# Altium schematic sheet MachSim.SchDoc
size 449 x 279 mm
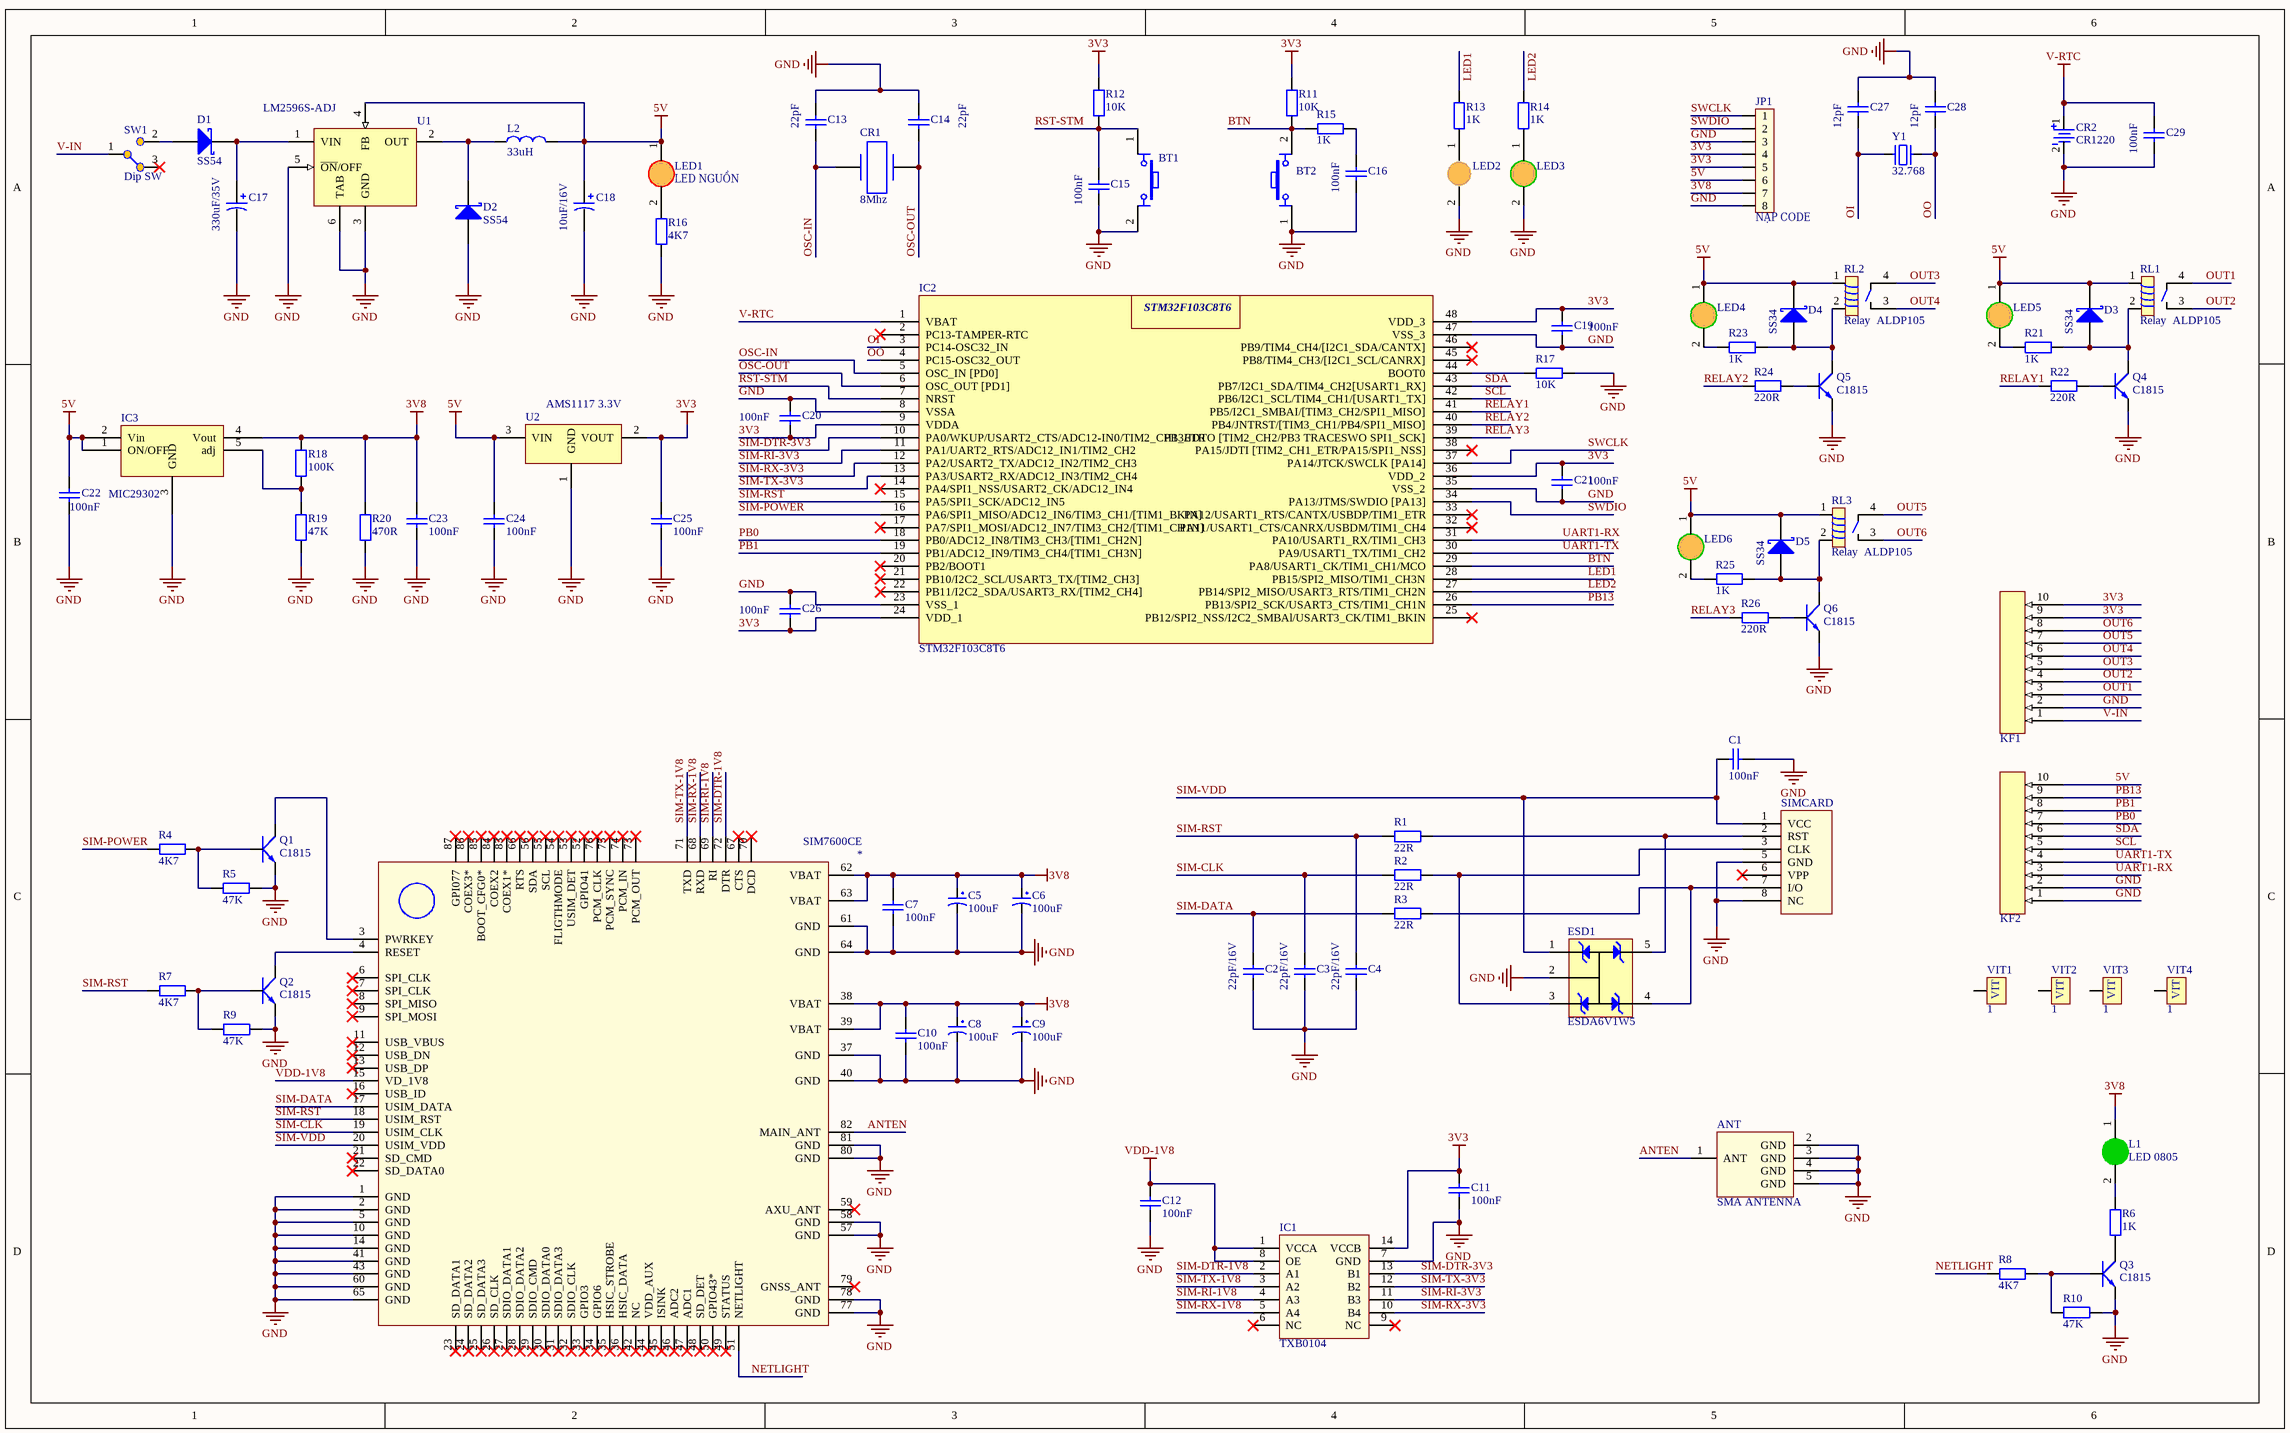
[diagram p0: MachSim.SchDoc]

## Parts
*  SIM7600CE  [SIM7600C]
ANT  ANT?  [ANT]  (value not drawn)
BT1  Nut Nhan 4 Chan Cam 6x6  [Nut Nhan 4 Chan Cam 6x6]  (value not drawn)
BT2  Nut Nhan 4 Chan Cam 6x6  [Nut Nhan 4 Chan Cam 6x6]  (value not drawn)
C1  100nF  [tu 0805]
C2  22pF/16V  [tu 0805]
C3  22pF/16V  [tu 0805]
C4  22pF/16V  [tu 0805]
C5  100uF  [tu tantalum smd3528]
C6  100uF  [tu tantalum smd3528]
C7  100nF  [tu 0805]
C8  100uF  [tu tantalum smd3528]
C9  100uF  [tu tantalum smd3528]
C10  100nF  [tu 0805]
C11  100nF  [tu 0805]
C12  100nF  [tu 0805]
C13  22pF  [tu 0805]
C14  22pF  [tu 0805]
C15  100nF  [tu 0805]
C16  100nF  [tu 0805]
C17  330uF/35V  [CAP_ALUM_SMD_100102_TYPE_G]
C18  10uF/16V  [CAP_ALUM_SMD_5054_TYPE_C]
C19  100nF  [tu 0805]
C20  100nF  [tu 0805]
C21  100nF  [tu 0805]
C22  100nF  [tu 0805]
C23  100nF  [tu 0805]
C24  100nF  [tu 0805]
C25  100nF  [tu 0805]
C26  100nF  [tu 0805]
C27  12pF  [tu 0805]
C28  12pF  [tu 0805]
C29  100nF  [tu 0805]
CR1  8Mhz  [Cry]
CR2  CR1220  [CR1220_HOLDER_SMD]
D1  SS54  [SS54]
D2  SS54  [SS54]
D3  SS34  [DIODE_DO214AC_SMA]
D4  SS34  [DIODE_DO214AC_SMA]
D5  SS34  [DIODE_DO214AC_SMA]
ESD1  ESDA6V1W5  [ESDA6V1W5]
IC1  TXB0104  [TXB0104]  (value not drawn)
IC2  STM32F103C8T6  [LQFP48]
IC3  MIC29302  [Mic5V]
JP1  NẠP CODE  [Jump Don Duc Thang 2.54_8p]
KF1  KF142R-10  [KF10]  (value not drawn)
KF2  KF142R-10  [KF10]  (value not drawn)
L1  LED 0805  [LED-0805-Green]
L2  33uH  [cuon cam cd74]
LED1  LED NGUỒN  [led 0805]
LED2  led trang 0805  [led 0805]  (value not drawn)
LED3  led xanh la 0805  [led 0805]  (value not drawn)
LED4  led xanh la 0805  [led 0805]  (value not drawn)
LED5  led xanh la 0805  [led 0805]  (value not drawn)
LED6  led xanh la 0805  [led 0805]  (value not drawn)
Q1  C1815  [SOT23B]
Q2  C1815  [SOT23B]
Q3  C1815  [SOT23B]
Q4  C1815  [SOT23B]
Q5  C1815  [SOT23B]
Q6  C1815  [SOT23B]
R1  22R  [tro 0805]
R2  22R  [tro 0805]
R3  22R  [tro 0805]
R4  4K7  [tro 0805]
R5  47K  [tro 0805]
R6  1K  [tro 0805]
R7  4K7  [tro 0805]
R8  4K7  [tro 0805]
R9  47K  [tro 0805]
R10  47K  [tro 0805]
R11  10K  [tro 0805]
R12  10K  [tro 0805]
R13  1K  [tro 0805]
R14  1K  [tro 0805]
R15  1K  [tro 0805]
R16  4K7  [tro 0805]
R17  10K  [tro 0805]
R18  100K  [tro 0805]
R19  47K  [tro 0805]
R20  470R  [tro 0805]
R21  1K  [tro 0805]
R22  220R  [tro 0805]
R23  1K  [tro 0805]
R24  220R  [tro 0805]
R25  1K  [tro 0805]
R26  220R  [tro 0805]
RL1  Relay  ALDP105  [Relay-4]
RL2  Relay  ALDP105  [Relay-4]
RL3  Relay  ALDP105  [Relay-4]
SIMCARD  Component_1  [SIM_CARD]  (value not drawn)
SW1  Dip SW  [SW3P]
U1  LM2596S-ADJ  [TO263-5]
U2  AMS1117 3.3V  [SOT223]
VIT1  1  [VIT]
VIT2  1  [VIT]
VIT3  1  [VIT]
VIT4  1  [VIT]
Y1  32.768  [THACHANH]

## Nets
3V3: C11.2 C19.1 C20.1 C21.1 C25.2 C26.1 IC1.14(VCCB) IC2.9(VDDA) IC2.24(VDD_1) IC2.36(VDD_2) IC2.48(VDD_3) JP1.4 JP1.5 KF1.9 KF1.10 R11.2 R12.2 U2.2(VOUT)
3V8: *.38(VBAT) *.39(VBAT) *.62(VBAT) *.63(VBAT) C5.1 C6.1 C7.2 C8.1 C9.1 C10.2 C23.2 IC3.4(Vout) JP1.7 L1.1(A) R18.2 R20.2
5V: C18.1 C22.2 C24.2 D3.2(K) D4.2(K) D5.2(K) IC3.1(ON/OFF) IC3.2(Vin) JP1.6 KF2.10 L2.2 LED1.1(A) LED4.1(A) LED5.1(A) LED6.1(A) RL1.1 RL2.1 RL3.1 U1.4(FB) U2.3(VIN)
GND: *.1(GND) *.2(GND) *.5(GND) *.10(GND) *.14(GND) *.37(GND) *.40(GND) *.41(GND) *.43(GND) *.57(GND) *.58(GND) *.60(GND) *.61(GND) *.64(GND) *.65(GND) *.77(GND) *.78(GND) *.80(GND) *.81(GND) ANT.2(GND) ANT.3(GND) ANT.4(GND) ANT.5(GND) BT1.2 BT2.1 C1.1 C2.2 C3.2 C4.2 C5.2 C6.2 C7.1 C8.2 C9.2 C10.1 C11.1 C12.1 C13.2 C14.2 C15.1 C16.1 C17.2 C18.2 C19.2 C20.2 C21.2 C22.1 C23.1 C24.1 C25.1 C26.2 C27.2 C28.2 C29.1 CR2.2(-) D2.1(A) ESD1.2 IC1.7(GND) IC2.8(VSSA) IC2.23(VSS_1) IC2.35(VSS_2) IC2.47(VSS_3) IC3.3(GND) JP1.3 JP1.8 KF1.2 KF2.1 KF2.2 LED2.2(K) LED3.2(K) Q1.1(E) Q2.1(E) Q3.1(E) Q4.1(E) Q5.1(E) Q6.1(E) R5.1 R9.2 R10.1 R16.1 R17.1 R19.1 R20.1 SIMCARD.5(GND) SIMCARD.8(NC) U1.3(GND) U1.5(~{ON}/OFF) U1.6(TAB) U2.1(GND)
V-RTC: C29.2 CR2.1(+) IC2.1(VBAT)
VDD-1V8: *.15(VD_1V8) C12.2 IC1.1(VCCA) IC1.8(OE)
ANTEN: *.82(MAIN_ANT) ANT.1(ANT)
BTN: BT2.2 IC2.29(PA8/USART1_CK/TIM1_CH1/MCO) R11.1 R15.2
LED1: IC2.28(PB15/SPI2_MISO/TIM1_CH3N) R13.1
LED2: IC2.27(PB14/SPI2_MISO/USART3_RTS/TIM1_CH2N) R14.1
NETLIGHT: *.51(NETLIGHT) R8.1
OI: C27.1 IC2.3(PC14-OSC32_IN) Y1.1
OO: C28.1 IC2.4(PC15-OSC32_OUT) Y1.2
OSC-IN: C13.1 CR1.2 IC2.5(OSC_IN_[PD0])
OSC-OUT: C14.1 CR1.1 IC2.6(OSC_OUT_[PD1])
OUT1: KF1.3 RL1.4
OUT2: KF1.4 RL1.3
OUT3: KF1.5 RL2.4
OUT4: KF1.6 RL2.3
OUT5: KF1.7 RL3.4
OUT6: KF1.8 RL3.3
PB0: IC2.18(PB0/ADC12_IN8/TIM3_CH3/[TIM1_CH2N]) KF2.7
PB1: IC2.19(PB1/ADC12_IN9/TIM3_CH4/[TIM1_CH3N]) KF2.8
PB13: IC2.26(PB13/SPI2_SCK/USART3_CTS/TIM1_CH1N) KF2.9
RELAY1: IC2.41(PB5/I2C1_SMBAI/[TIM3_CH2/SPI1_MISO]) R22.1
RELAY2: IC2.40(PB4/JNTRST/[TIM3_CH1/PB4/SPI1_MISO]) R24.1
RELAY3: IC2.39(PB3/JDTO_[TIM2_CH2/PB3_TRACESWO_SPI1_SCK]) R26.1
RST-STM: BT1.1 C15.2 IC2.7(NRST) R12.1
SCL: IC2.42(PB6/I2C1_SCL/TIM4_CH1/[USART1_TX]) KF2.5
SDA: IC2.43(PB7/I2C1_SDA/TIM4_CH2[USART1_RX]) KF2.6
SIM-CLK: *.19(USIM_CLK) C3.1 R2.1
SIM-DATA: *.17(USIM_DATA) C2.1 R3.1
SIM-DTR-1V8: *.72(DTR) IC1.2(A1)
SIM-DTR-3V3: IC1.13(B1) IC2.10(PA0/WKUP/USART2_CTS/ADC12-IN0/TIM2_CH1_ETR)
SIM-POWER: IC2.16(PA6/SPI1_MISO/ADC12_IN6/TIM3_CH1/[TIM1_BKIN]) R4.1
SIM-RI-1V8: *.69(RI) IC1.4(A3)
SIM-RI-3V3: IC1.11(B3) IC2.11(PA1/UART2_RTS/ADC12_IN1/TIM2_CH2)
SIM-RST: *.18(USIM_RST) C4.1 IC2.15(PA5/SPI1_SCK/ADC12_IN5) R1.1 R7.1
SIM-RX-1V8: *.68(RXD) IC1.5(A4)
SIM-RX-3V3: IC1.10(B4) IC2.12(PA2/USART2_TX/ADC12_IN2/TIM2_CH3)
SIM-TX-1V8: *.71(TXD) IC1.3(A2)
SIM-TX-3V3: IC1.12(B2) IC2.13(PA3/USART2_RX/ADC12_IN3/TIM2_CH4)
SIM-VDD: *.20(USIM_VDD) C1.2 ESD1.1 SIMCARD.1(VCC)
SWCLK: IC2.37(PA14/JTCK/SWCLK_[PA14]) JP1.1
SWDIO: IC2.34(PA13/JTMS/SWDIO_[PA13]) JP1.2
UART1-RX: IC2.31(PA10/USART1_RX/TIM1_CH3) KF2.3
UART1-TX: IC2.30(PA9/USART1_TX/TIM1_CH2) KF2.4
V-IN: KF1.1 SW1.1(COM)
Net*_3: *.3(PWRKEY) Q1.2(C)
Net*_4: *.4(RESET) Q2.2(C)
NetC16_2: C16.2 R15.1
NetC17_1: C17.1 D1.2(K) U1.1(VIN)
NetD1_1: D1.1(A) SW1.2(NC)
NetD2_2: D2.2(K) L2.1 U1.2(OUT)
NetD3_1: D3.1(A) Q4.2(C) R21.2 RL1.2
NetD4_1: D4.1(A) Q5.2(C) R23.2 RL2.2
NetD5_1: D5.1(A) Q6.2(C) R25.2 RL3.2
NetESD1_3: ESD1.3 R2.2 SIMCARD.3(CLK)
NetESD1_4: ESD1.4 R3.2 SIMCARD.7(I/O)
NetESD1_5: ESD1.5 R1.2 SIMCARD.2(RST)
NetIC2_44: IC2.44(BOOT0) R17.2
NetIC3_5: IC3.5(adj) R18.1 R19.2
NetL1_2: L1.2(K) R6.1
NetLED1_2: LED1.2(K) R16.2
NetLED2_1: LED2.1(A) R13.2
NetLED3_1: LED3.1(A) R14.2
NetLED4_2: LED4.2(K) R23.1
NetLED5_2: LED5.2(K) R21.1
NetLED6_2: LED6.2(K) R25.1
NetQ1_3: Q1.3(B) R4.2 R5.2
NetQ2_3: Q2.3(B) R7.2 R9.1
NetQ3_2: Q3.2(C) R6.2
NetQ3_3: Q3.3(B) R8.2 R10.2
NetQ4_3: Q4.3(B) R22.2
NetQ5_3: Q5.3(B) R24.2
NetQ6_3: Q6.3(B) R26.2

Not connected (* = marked no-connect by the designer): * 6(SPI_CLK)* 7(SPI_CLK)* 8(SPI_MISO)* 9(SPI_MOSI)* 11(USB_VBUS)* 12(USB_DN)* 13(USB_DP)* 16(USB_ID)* 21(SD_CMD)* 22(SD_DATA0)* 23(SD_DATA1)* 24(SD_DATA2)* 25(SD_DATA3)* 26(SD_CLK)* 27(SDIO_DATA1)* 28(SDIO_DATA2)* 29(SDIO_CMD)* 30(SDIO_DATA0)* 31(SDIO_DATA3)* 32(SDIO_CLK)* 33(GPIO3)* 34(GPIO6)* 35(HSIC_STROBE)* 36(HSIC_DATA)* 42(NC)* 44(VDD_AUX)* 45(ISINK)* 46(ADC2)* 47(ADC1)* 48(SD_DET)* 49(STATUS)* 50(GPIO43*)* 52(GPIO41)* 53(USIM_DET)* 54(FLIGTHMODE)* 55(SCL)* 56(SDA)* 59(AXU_ANT)* 66(RTS)* 67(CTS)* 70(DCD)* 73(PCM_OUT)* 74(PCM_IN)* 75(PCM_SYNC)* 76(PCM_CLK)* 79(GNSS_ANT)* 83(COEX1*)* 84(COEX2)* 85(BOOT_CFG0*)* 86(COEX3*)* 87(GPI077)*; IC1 6(NC)* 9(NC)*; IC2 2(PC13-TAMPER-RTC)* 14(PA4/SPI1_NSS/USART2_CK/ADC12_IN4)* 17(PA7/SPI1_MOSI/ADC12_IN7/TIM3_CH2/[TIM1_CH1N])* 20(PB2/BOOT1)* 21(PB10/I2C2_SCL/USART3_TX/[TIM2_CH3])* 22(PB11/I2C2_SDA/USART3_RX/[TIM2_CH4])* 25(PB12/SPI2_NSS/I2C2_SMBAl/USART3_CK/TIM1_BKIN)* 32(PA11/USART1_CTS/CANRX/USBDM/TIM1_CH4)* 33(PA12/USART1_RTS/CANTX/USBDP/TIM1_ETR)* 38(PA15/JDTI_[TIM2_CH1_ETR/PA15/SPI1_NSS])* 45(PB8/TIM4_CH3/[I2C1_SCL/CANRX])* 46(PB9/TIM4_CH4/[I2C1_SDA/CANTX])*; SIMCARD 6(VPP)*; SW1 3(NO)*; VIT1 VIT1(1); VIT2 VIT1(1); VIT3 VIT1(1); VIT4 VIT1(1)

## Notes on the sheet
- (in symbol ANT) SMA ANTENNA

## Library data of the parts
ANT = ANT
BT1 BT2 = Nut Nhan 4 Chan Cam 6x6: Nut Nhan 4 Chan 6x6mm; Ten: Nút Nhấn 4 Chân 6x6x5MM DIP; Ma_Hang: MH004584
C1 C7 C10-C16 C19-C29 = Tu 0805 10pF 50V 10%: Dán; Don_Vi: Con; So_Chan: 2; Ten_Linh_Kien: Tụ 0805 10P 10% 50V; Ma_Hang: MH004554; Chung_Loai: Dán; Kieu_Chan: *
C2-C4 = Tu 0805 6.8nF 50V 10%: Dán; Don_Vi: Con; Ten_Linh_Kien: Tụ 0805 6.8nF 10% 50V; Ma_Hang: MH009987; Chung_Loai: Dán
C5 C6 C8 C9 = Tu tantalum 100uF 6.3V SMD3528: Dán; Don_Vi: Con; So_Chan: 2; Ten_Linh_Kien: Tụ tantalum 107J-100uF 6.3V SMD3528; Ma_Hang: MH007595; Chung_Loai: Dán; Kieu_Chan: *
C17 = EEE-FK1C331P: CAP ALUM 330uF 20% 35V SMD; MFR: Panasonic; Solder: SMT; Value: 330uF/35V; MPN: EEE-FK1C331P; Category: CAPACITOR; PinCount: 2
C18 = EEE-FK1C330P: CAP ALUM 33uF 20% 16V SMD; MFR: Panasonic; Value: 33uF/16V; Solder: SMT; MPN: EEE-FK1C330P; Category: CAPACITOR; PinCount: 2
CR1 = Crystal-8Mhz: Thạch Anh 8MHz 5032 2 Chân Crystal; ComponentLink1Description: Thạch Anh 8MHz 5032 2 Chân Crystal; ComponentLink1URL: https://www.thegioiic.com/products/thach-anh-8mhz-5032-2-chan-crystal
D1 D2 = SS34: DIODE SCHOTTKY 40V 3A SMA; Solder: SMT; Value: SS34; MPN: SS34; MFR: *
D3-D5 = SS34: DIODE SCHOTTKY 40V 3A SMA; Solder: SMT; MPN: SS34; Value: SS34; MFR: *
IC2 = STM32F103C8T6: Dán; Ten_Linh_Kien: STM32F103C8T6 LQFP48; Ma_Hang: MH000567; Don_Vi: Con; So_Chan: 48; Kieu_Chan: LQFP48; Chung_Loai: Dán
JP1 = Jump Don Duc 2.54_8P: Cắm; Ten_Linh_Kien: Jump Đơn Đực 2.54MM 1x40P Thẳng 11MM; Ma_Hang: MH000903; Don_Vi: Con; Ghi_Chu: *; Kieu Chan: *; Chung_Loai: Cắm
KF1 KF2 = KF10: KF142R-10P-5.08mm
L1 = LED 0805 Xanh La: Dán; Don_Vi: Con; Ma_Hang: MH002326; Ten_Linh_Kien: LED 0805 Màu Xanh Lá (Green); Ghi_Chu: *; Kieu_Chan: *; Chung_Loai: Dán
L2 = cuon cam 33uH 330 3A 12x12x7MM: Dán; Kieu_Chan: CD74; Don_Vi: Con; So_Chan: 2; Ma_Hang: MH003999; Chung_Loai: Dán; Ten_Linh_Kien: cuon cam 33uH 330 3A 12x12x7MM
LED1 = Led 0805 Do: Dán; Don_Vi: Con; So_Chan: 2; Ten_Linh_Kien: LED 0805 Màu Đỏ; Ma_Hang: MH000897; Chung_Loai: Dán; Kieu_Chan: *
LED2 = Led 0805 Trang: Dán; Don_Vi: Con; So_Chan: 2; Ten_Linh_Kien: LED 0805 Màu Trắng (White); Ma_Hang: MH002946; Chung_Loai: Dán; Kieu_Chan: *
LED3-LED6 = Led 0805 Xanh la: Dán; Don_Vi: Con; So_Chan: 2; Ten_Linh_Kien: LED 0805 Màu Xanh lá (Green); Ma_Hang: MH002326; Chung_Loai: Dán; Kieu_Chan: *
Q1-Q6 = C1815: Dán; Ten_Linh_Kien: C1815 SOT23 TRANS NPN 0.15A 50V (SMD-HF); Don_Vi: Con; Ma_Hang: MH000946; Ghi_Chu: *; Kieu_Chan: *; Chung_Loai: Dán
R1-R26 = Tro 0805 1% 1k: Dán; Don_Vi: Con; So_Chan: 2; Ten_Linh_Kien: Trở 0805 1% 1k; Ma_Hang: MH005468; Chung_Loai: Dán; Kieu_Chan: *
RL1-RL3 = Relay HF46: SUBMINIATURE INTERMEDIATE POWER RELAY
SW1 = Switch3P: Dip Switch 3 pin
U1 = LM2596S-ADJ: SIMPLE SWITCHER Power Converter 150 KHz 3A Step-Down Voltage Regulator; MPN: LM2596SX-ADJ/NOPB; Solder: SMT; Value: LM2596S-ADJ; Category: IC
U2 = AMS1117 3.3V: Dán; Ten_Linh_Kien: AMS1117-3.3V SOT223; Don_Vi: Con; So_Chan: 4; Ma_Hang: MH000596; Kieu_Chan: SOT223; Chung_Loai: Dán
VIT1-VIT4 = VIT: Oc Vit
Y1 = Thach Anh 2 chan 32,768 Khz: Crystal For all Crystal 2pin.; Value: 4Mhz